# EAGLE design sensorboard (EAGLE 7.6.0)
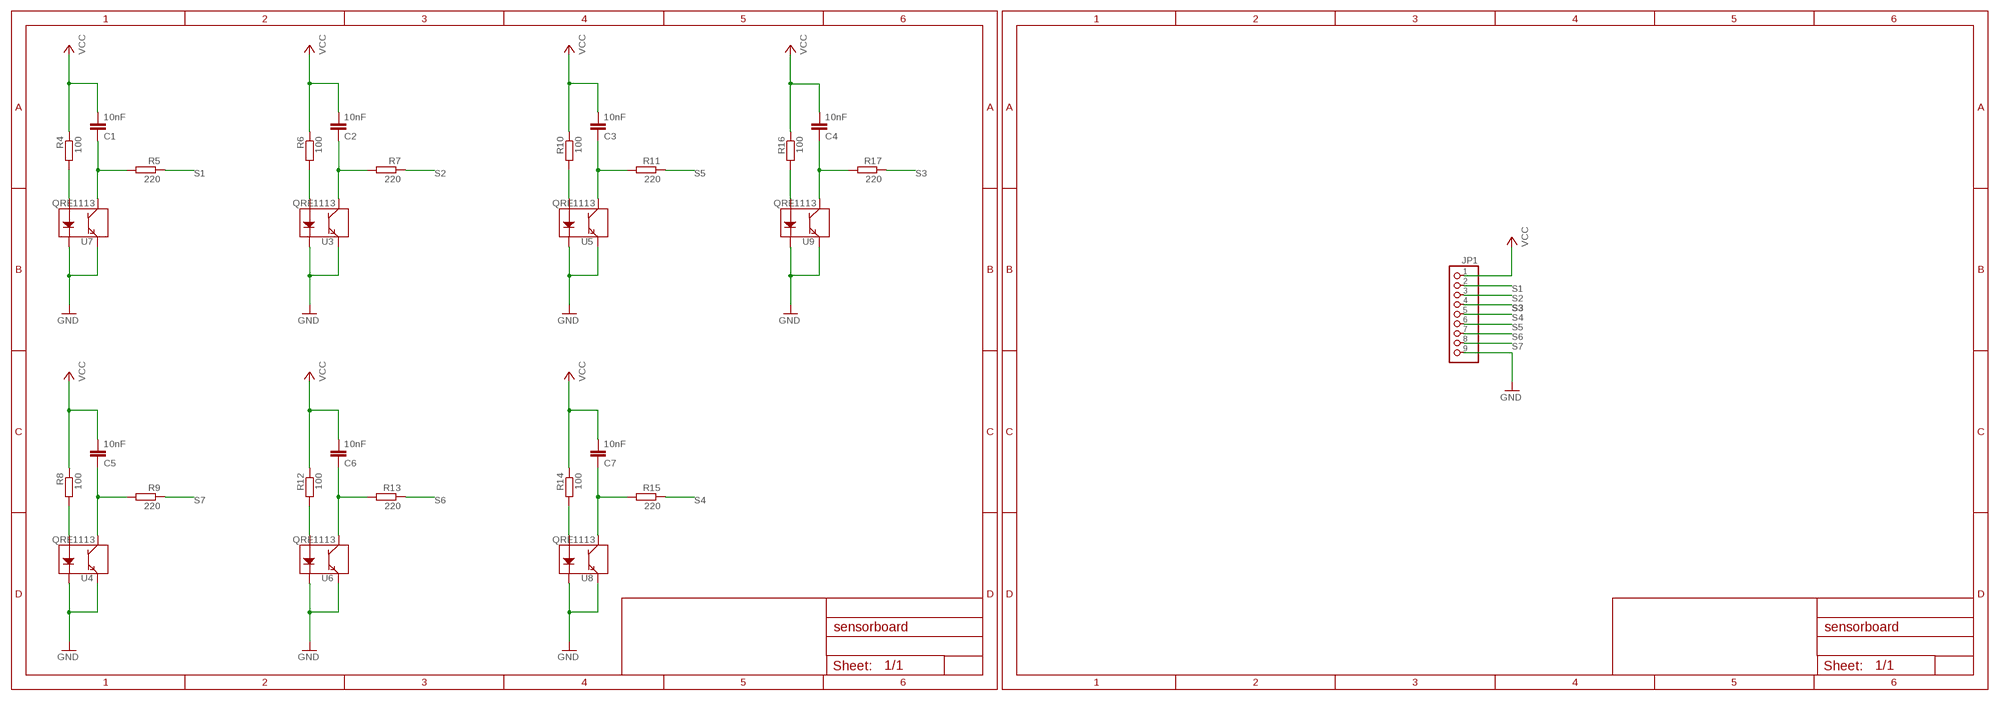
[diagram p0: schematic, sheet 1]

## Parts
C1  10nF  C-EUC0805K  [C0805K]
C2  10nF  C-EUC0805K  [C0805K]
C3  10nF  C-EUC0805K  [C0805K]
C4  10nF  C-EUC0805K  [C0805K]
C5  10nF  C-EUC0805K  [C0805K]
C6  10nF  C-EUC0805K  [C0805K]
C7  10nF  C-EUC0805K  [C0805K]
JP1  PINHD-1X9  [1X09]
R4  100  R-EU_M0805  [M0805]
R5  220  R-EU_M0805  [M0805]
R6  100  R-EU_M0805  [M0805]
R7  220  R-EU_M0805  [M0805]
R8  100  R-EU_M0805  [M0805]
R9  220  R-EU_M0805  [M0805]
R10  100  R-EU_M0805  [M0805]
R11  220  R-EU_M0805  [M0805]
R12  100  R-EU_M0805  [M0805]
R13  220  R-EU_M0805  [M0805]
R14  100  R-EU_M0805  [M0805]
R15  220  R-EU_M0805  [M0805]
R16  100  R-EU_M0805  [M0805]
R17  220  R-EU_M0805  [M0805]
U3  QRE1113  [QRE1113]
U4  QRE1113  [QRE1113]
U5  QRE1113  [QRE1113]
U6  QRE1113  [QRE1113]
U7  QRE1113  [QRE1113]
U8  QRE1113  [QRE1113]
U9  QRE1113  [QRE1113]

## Nets
GND: JP1.9 U3.2(K) U3.4(E) U4.2(K) U4.4(E) U5.2(K) U5.4(E) U6.2(K) U6.4(E) U7.2(K) U7.4(E) U8.2(K) U8.4(E) U9.2(K) U9.4(E)
N$1: C1.1 R5.2 U7.3(C)
N$2: C2.1 R7.2 U3.3(C)
N$3: C3.1 R11.2 U5.3(C)
N$4: C4.1 R17.2 U9.3(C)
N$5: C7.1 R15.2 U8.3(C)
N$6: C6.1 R13.2 U6.3(C)
N$7: C5.1 R9.2 U4.3(C)
N$8: R4.2 U7.1(A)
N$9: R6.2 U3.1(A)
N$10: R8.2 U4.1(A)
N$11: R10.2 U5.1(A)
N$12: R12.2 U6.1(A)
N$13: R14.2 U8.1(A)
N$14: R16.2 U9.1(A)
S1: JP1.2 R5.1
S2: JP1.3 R7.1
S3: JP1.4 R17.1
S4: JP1.5 R15.1
S5: JP1.6 R11.1
S6: JP1.7 R13.1
S7: JP1.8 R9.1
VCC: C1.2 C2.2 C3.2 C4.2 C5.2 C6.2 C7.2 JP1.1 R4.1 R6.1 R8.1 R10.1 R12.1 R14.1 R16.1

## Library data of the parts
C1-C7 = resistor:C-EU: CAPACITOR, European symbol
JP1 = pinhead:PINHD-1X9: PIN HEADER
R4-R17 = resistor:R-EU_: RESISTOR, European symbol
U3-U9 = SparkFun-Sensors:QRE1113: Reflective object sensor; PROD_ID: IC-09357

## Board
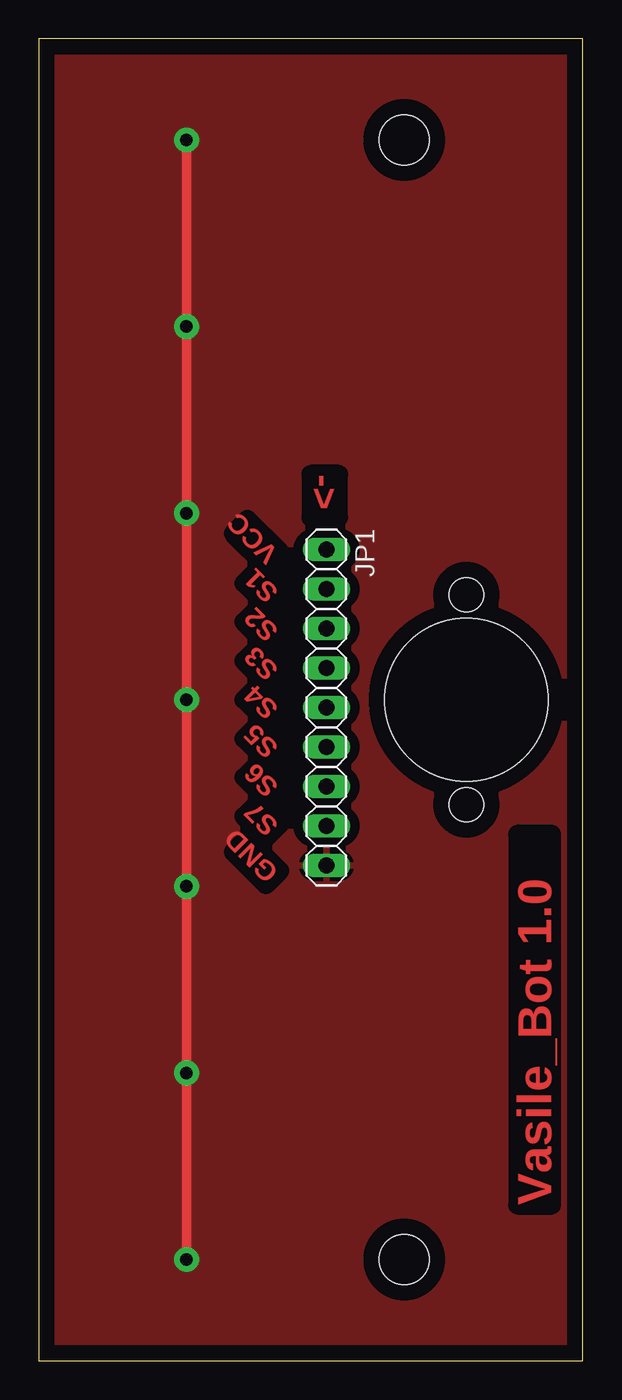
[diagram p1: board, top side]
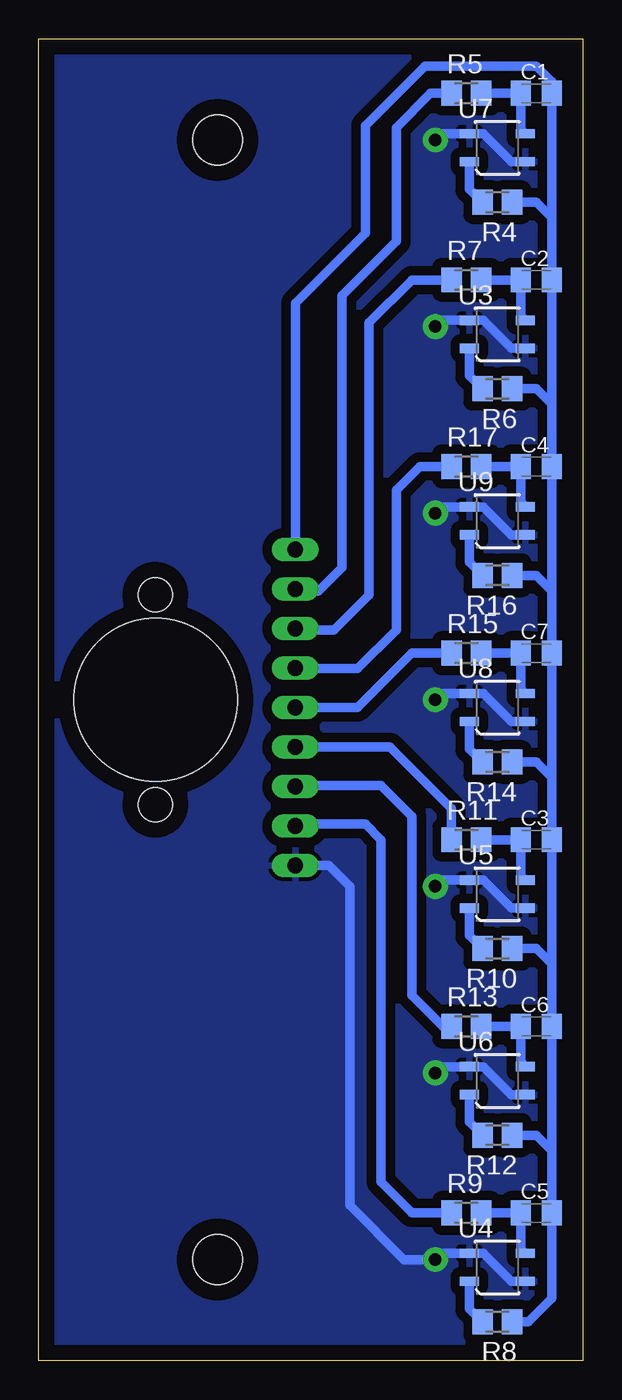
[diagram p2: board, bottom side, seen from below]

Size 35 x 85 mm. Coordinates in mm from the lower left corner, seen from the top.
Outline: 0,0 35,0 35,85 0,85 0,0
Copper layers (1*16): Top 0.035mm / dielectric 1.5mm / Bottom 0.035mm
Design rules "default *": minimum track width 10mil, minimum drill 24mil, track to track 8mil, track to pad 8mil, pad to pad 8mil, via to via 8mil, smd to smd 8mil, copper to edge 40mil, drill to drill 8mil, minimum pad ring 10mil, minimum via ring 8mil, stop-mask expansion 4mil, vias tented up to drill 0mil, thermal gap 10mil
Holes 3.2 mm at 23.5,78.5 23.5,6.5
Holes 10.5 mm at 27.5,42.5
Holes 2.2 mm at 27.5,49.25 27.5,35.75

### Footprints (pad centres in the part's own frame; a part is rotated, then mirrored left to right if it is on the bottom)
C0805K = smd 1.3 x 1.6: 1 -1,0; 2 1,0
1X09 = drill 1.016 long: 1 -10.16,0; 2 -7.62,0; 3 -5.08,0; 4 -2.54,0; 5 0,0; 6 2.54,0; 7 5.08,0; 8 7.62,0; 9 10.16,0
M0805 = smd 1.3 x 1.6: 1 -0.95,0; 2 0.95,0
QRE1113 = smd 1.2 x 0.6: 1 -1.8,-0.9; 2 1.8,-0.9; 3 1.8,0.9; 4 -1.8,0.9

### Placement (x,y rotation side)
C1  3,81.5 0 bottom
C2  3,69.5 0 bottom
C3  3,33.5 0 bottom
C4  3,57.5 0 bottom
C5  3,9.5 0 bottom
C6  3,21.5 0 bottom
C7  3,45.5 0 bottom
JP1  18.5,42 270 top
R4  5.5,74.5 180 bottom
R5  7.5,81.5 0 bottom
R6  5.5,62.5 180 bottom
R7  7.5,69.5 0 bottom
R8  5.5,2.5 180 bottom
R9  7.5,9.5 0 bottom
R10  5.5,26.5 180 bottom
R11  7.5,33.5 0 bottom
R12  5.5,14.5 180 bottom
R13  7.5,21.5 0 bottom
R14  5.5,38.5 180 bottom
R15  7.5,45.5 0 bottom
R16  5.5,50.5 180 bottom
R17  7.5,57.5 0 bottom
U3  5.5,66 0 bottom
U4  5.5,6 0 bottom
U5  5.5,30 0 bottom
U6  5.5,18 0 bottom
U7  5.5,78 0 bottom
U8  5.5,42 0 bottom
U9  5.5,54 0 bottom

### Tracks (layer width: path | path; a pad name or v marks a point on that pad's centre or on a via)
GND  (via drill 0.8 pad 1.6)
  Top 0.61: v9.5,6.5 v9.5,18.5 v9.5,30.5 v9.5,42.5 v9.5,54.5 v9.5,66.5 v9.5,78.5
  Bottom 0.61: U6.2 4.6,17.1 6.4,18.9 U6.4 9.1,18.9 v9.5,18.5 | U5.2 4.6,29.1 6.4,30.9 U5.4 9.1,30.9 v9.5,30.5 | U8.2 4.6,41.1 6.4,42.9 U8.4 9.1,42.9 v9.5,42.5 | U9.2 4.6,53.1 6.4,54.9 U9.4 9.1,54.9 v9.5,54.5 | U7.2 4.6,77.1 6.4,78.9 U7.4 9.1,78.9 v9.5,78.5 | U3.2 4.6,65.1 6.4,66.9 U3.4 9.1,66.9 v9.5,66.5 | U4.2 4.6,5.1 6.4,6.9 U4.4 9.1,6.9 v9.5,6.5 11.5,6.5 15,10 15,30.5 16.34,31.84 JP1.9
  pour Top (isolate 0.61): 0,85 35,85 35,0 0,0
  pour Bottom (isolate 0.61): 0,85 35,85 35,0 0,0
N$1
  Bottom 0.61: R5.2 C1.1 4,79.2 U7.3
N$2
  Bottom 0.61: U3.3 4,67.2 C2.1 R7.2
N$3
  Bottom 0.61: U5.3 4,31.2 C3.1 R11.2
N$4
  Bottom 0.61: U9.3 4,55.2 C4.1 R17.2
N$5
  Bottom 0.61: U8.3 4,43.2 C7.1 R15.2
N$6
  Bottom 0.61: U6.3 4,19.2 C6.1 R13.2
N$7
  Bottom 0.61: U4.3 4,7.2 C5.1 R9.2
N$8
  Bottom 0.61: U7.1 7.3,75.35 R4.2
N$9
  Bottom 0.61: U3.1 7.3,63.35 R6.2
N$10
  Bottom 0.61: U4.1 7.3,3.35 R8.2
N$11
  Bottom 0.61: U5.1 7.3,27.35 R10.2
N$12
  Bottom 0.61: U6.1 7.3,15.35 R12.2
N$13
  Bottom 0.61: U8.1 7.3,39.35 R14.2
N$14
  Bottom 0.61: U9.1 7.3,51.35 R16.2
S1
  Bottom 0.61: JP1.2 18.38,49.5 17,49.5 15.5,51 15.5,68.5 12,72 12,79.3 9.8,81.5 R5.1
S2
  Bottom 0.61: JP1.3 18.42,47 16,47 13.75,49.25 13.75,66.75 11,69.5 R7.1
S3
  Bottom 0.61: JP1.4 18.46,44.5 14.5,44.5 12,47 12,56 10.5,57.5 R17.1
S4
  Bottom 0.61: JP1.5 14.5,42 11,45.5 R15.1
S5
  Bottom 0.61: JP1.6 12.41,39.46 8.45,35.5 R11.1
S6
  Bottom 0.61: JP1.7 18.42,37 13,37 11,35 11,23.5 9,21.5 R13.1
S7
  Bottom 0.61: JP1.8 18.38,34.5 14,34.5 13,33.5 13,11.5 11,9.5 R9.1
VCC
  Bottom 0.61: R8.1 3.5,2.5 2,4 C5.2 2,13.5 | 2,13.5 C6.2 2,25.5 | 2,73.5 C1.2 2,82.25 3,83.25 10.18,83.25 14,79.42 14,72.5 18.5,68 JP1.1 | 2,73.5 C2.2 2,61.5 | 2,61.5 C4.2 2,49.5 | 2,49.5 C7.2 2,37.5 | 2,37.5 C3.2 2,25.5 | R12.1 3,14.5 2,13.5 | R10.1 3,26.5 2,25.5 | R14.1 3,38.5 2,37.5 | R16.1 3,50.5 2,49.5 | R6.1 3,62.5 2,61.5 | R4.1 3,74.5 2,73.5

### Text on the board
Top: -> | VCC | S1 | S2 | S3 | S4 | S5 | S6 | S7 | GND | Vasile_Bot 1.0